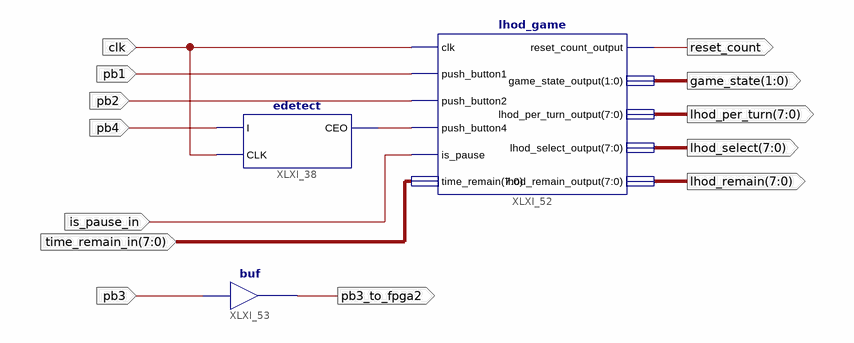
[diagram p0: schematic sheet 1]
// Xilinx ISE schematic game_logic.sch (spartan6) as structural Verilog: 3 symbols, 13 ports
module game_logic (
  input  pb1,
  input  pb2,
  input  is_pause_in,
  input  [7:0] time_remain_in,
  input  clk,
  input  pb4,
  input  pb3,
  output [1:0] game_state,
  output reset_count,
  output [7:0] lhod_per_turn,
  output [7:0] lhod_select,
  output [7:0] lhod_remain,
  output pb3_to_fpga2
);

  wire XLXN_233;

  lhod_game XLXI_52 (
    .clk(clk), .push_button1(pb1), .push_button2(pb2), .push_button4(XLXN_233), .is_pause(is_pause_in),
    .time_remain(time_remain_in), .reset_count_output(reset_count), .game_state_output(game_state),
    .lhod_per_turn_output(lhod_per_turn), .lhod_select_output(lhod_select), .lhod_remain_output(lhod_remain));
  edetect XLXI_38 (.CEO(XLXN_233), .CLK(clk), .I(pb4));
  buf XLXI_53 (pb3_to_fpga2, pb3);
endmodule
